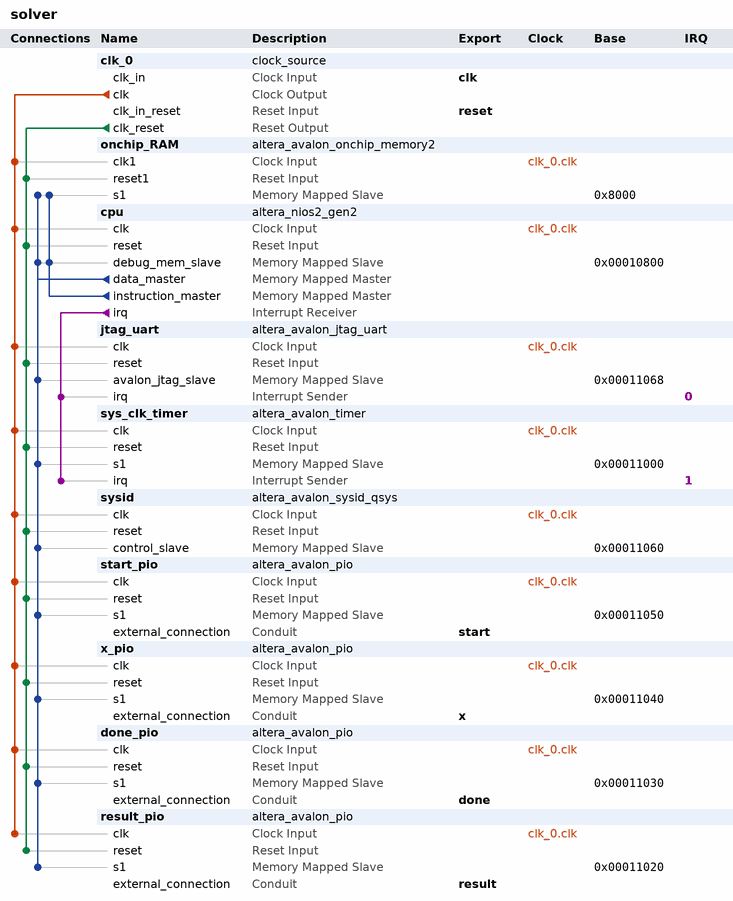
[diagram p0: system contents]
# Platform Designer (Qsys) system solver, Cyclone V 5CSEMA5F31C6
# Parameters at their usual value, and those the tool derives, are not listed.
package require -exact qsys 23.1
create_system solver
set_project_property DEVICE_FAMILY {Cyclone V}
set_project_property DEVICE 5CSEMA5F31C6

add_instance clk_0 clock_source 23.1
set_instance_parameter_value clk_0 clockFrequency 50000000

add_instance onchip_RAM altera_avalon_onchip_memory2 23.1
set_instance_parameter_value onchip_RAM dataWidth 32
set_instance_parameter_value onchip_RAM dualPort false
set_instance_parameter_value onchip_RAM initMemContent true
set_instance_parameter_value onchip_RAM initializationFileName onchip_mem.hex
set_instance_parameter_value onchip_RAM memorySize 24000

add_instance cpu altera_nios2_gen2 23.1
set_instance_parameter_value cpu dcache_size 2048
set_instance_parameter_value cpu exceptionSlave onchip_RAM.s1
set_instance_parameter_value cpu icache_size 4096
set_instance_parameter_value cpu impl Fast
set_instance_parameter_value cpu mul_32_impl 0
set_instance_parameter_value cpu mul_shift_choice 1
set_instance_parameter_value cpu resetSlave onchip_RAM.s1

add_instance jtag_uart altera_avalon_jtag_uart 23.1
set_instance_parameter_value jtag_uart simInteractiveOptions NO_INTERACTIVE_WINDOWS

add_instance sys_clk_timer altera_avalon_timer 23.1
set_instance_parameter_value sys_clk_timer period 1
set_instance_parameter_value sys_clk_timer periodUnits MSEC

add_instance sysid altera_avalon_sysid_qsys 23.1
set_instance_parameter_value sysid id 286331153

add_instance start_pio altera_avalon_pio 23.1
set_instance_parameter_value start_pio direction Input
set_instance_parameter_value start_pio width 1

add_instance x_pio altera_avalon_pio 23.1
set_instance_parameter_value x_pio direction Input
set_instance_parameter_value x_pio width 32

add_instance done_pio altera_avalon_pio 23.1
set_instance_parameter_value done_pio direction Output
set_instance_parameter_value done_pio width 1

add_instance result_pio altera_avalon_pio 23.1
set_instance_parameter_value result_pio direction Output
set_instance_parameter_value result_pio width 32

# connections
add_connection clk_0.clk cpu.clk clock
add_connection clk_0.clk done_pio.clk clock
add_connection clk_0.clk jtag_uart.clk clock
add_connection clk_0.clk onchip_RAM.clk1 clock
add_connection clk_0.clk result_pio.clk clock
add_connection clk_0.clk start_pio.clk clock
add_connection clk_0.clk sys_clk_timer.clk clock
add_connection clk_0.clk sysid.clk clock
add_connection clk_0.clk x_pio.clk clock
add_connection clk_0.clk_reset cpu.reset reset
add_connection clk_0.clk_reset done_pio.reset reset
add_connection clk_0.clk_reset jtag_uart.reset reset
add_connection clk_0.clk_reset onchip_RAM.reset1 reset
add_connection clk_0.clk_reset result_pio.reset reset
add_connection clk_0.clk_reset start_pio.reset reset
add_connection clk_0.clk_reset sys_clk_timer.reset reset
add_connection clk_0.clk_reset sysid.reset reset
add_connection clk_0.clk_reset x_pio.reset reset
add_connection cpu.data_master cpu.debug_mem_slave avalon
set_connection_parameter_value cpu.data_master/cpu.debug_mem_slave baseAddress 0x00010800
add_connection cpu.data_master done_pio.s1 avalon
set_connection_parameter_value cpu.data_master/done_pio.s1 baseAddress 0x00011030
add_connection cpu.data_master jtag_uart.avalon_jtag_slave avalon
set_connection_parameter_value cpu.data_master/jtag_uart.avalon_jtag_slave baseAddress 0x00011068
add_connection cpu.data_master onchip_RAM.s1 avalon
set_connection_parameter_value cpu.data_master/onchip_RAM.s1 baseAddress 0x8000
add_connection cpu.data_master result_pio.s1 avalon
set_connection_parameter_value cpu.data_master/result_pio.s1 baseAddress 0x00011020
add_connection cpu.data_master start_pio.s1 avalon
set_connection_parameter_value cpu.data_master/start_pio.s1 baseAddress 0x00011050
add_connection cpu.data_master sys_clk_timer.s1 avalon
set_connection_parameter_value cpu.data_master/sys_clk_timer.s1 baseAddress 0x00011000
add_connection cpu.data_master sysid.control_slave avalon
set_connection_parameter_value cpu.data_master/sysid.control_slave baseAddress 0x00011060
add_connection cpu.data_master x_pio.s1 avalon
set_connection_parameter_value cpu.data_master/x_pio.s1 baseAddress 0x00011040
add_connection cpu.instruction_master cpu.debug_mem_slave avalon
set_connection_parameter_value cpu.instruction_master/cpu.debug_mem_slave baseAddress 0x00010800
add_connection cpu.instruction_master onchip_RAM.s1 avalon
set_connection_parameter_value cpu.instruction_master/onchip_RAM.s1 baseAddress 0x8000
add_connection cpu.irq jtag_uart.irq interrupt
set_connection_parameter_value cpu.irq/jtag_uart.irq irqNumber 0
add_connection cpu.irq sys_clk_timer.irq interrupt
set_connection_parameter_value cpu.irq/sys_clk_timer.irq irqNumber 1

# exported interfaces
add_interface clk clock sink
set_interface_property clk EXPORT_OF clk_0.clk_in
add_interface done conduit end
set_interface_property done EXPORT_OF done_pio.external_connection
add_interface reset reset sink
set_interface_property reset EXPORT_OF clk_0.clk_in_reset
add_interface result conduit end
set_interface_property result EXPORT_OF result_pio.external_connection
add_interface start conduit end
set_interface_property start EXPORT_OF start_pio.external_connection
add_interface x conduit end
set_interface_property x EXPORT_OF x_pio.external_connection

set_interconnect_requirement {$system} qsys_mm.clockCrossingAdapter HANDSHAKE
set_interconnect_requirement {$system} qsys_mm.enableEccProtection FALSE
set_interconnect_requirement {$system} qsys_mm.insertDefaultSlave FALSE
set_interconnect_requirement {$system} qsys_mm.maxAdditionalLatency 1

save_system solver.qsys
